# Altium project old_singleboard_now_mcu.PrjPcb (part 2 of 4)

## Sheet vca_A.SchDoc
size 381 x 241 mm; SheetNumber: 3; SheetTotal: 12
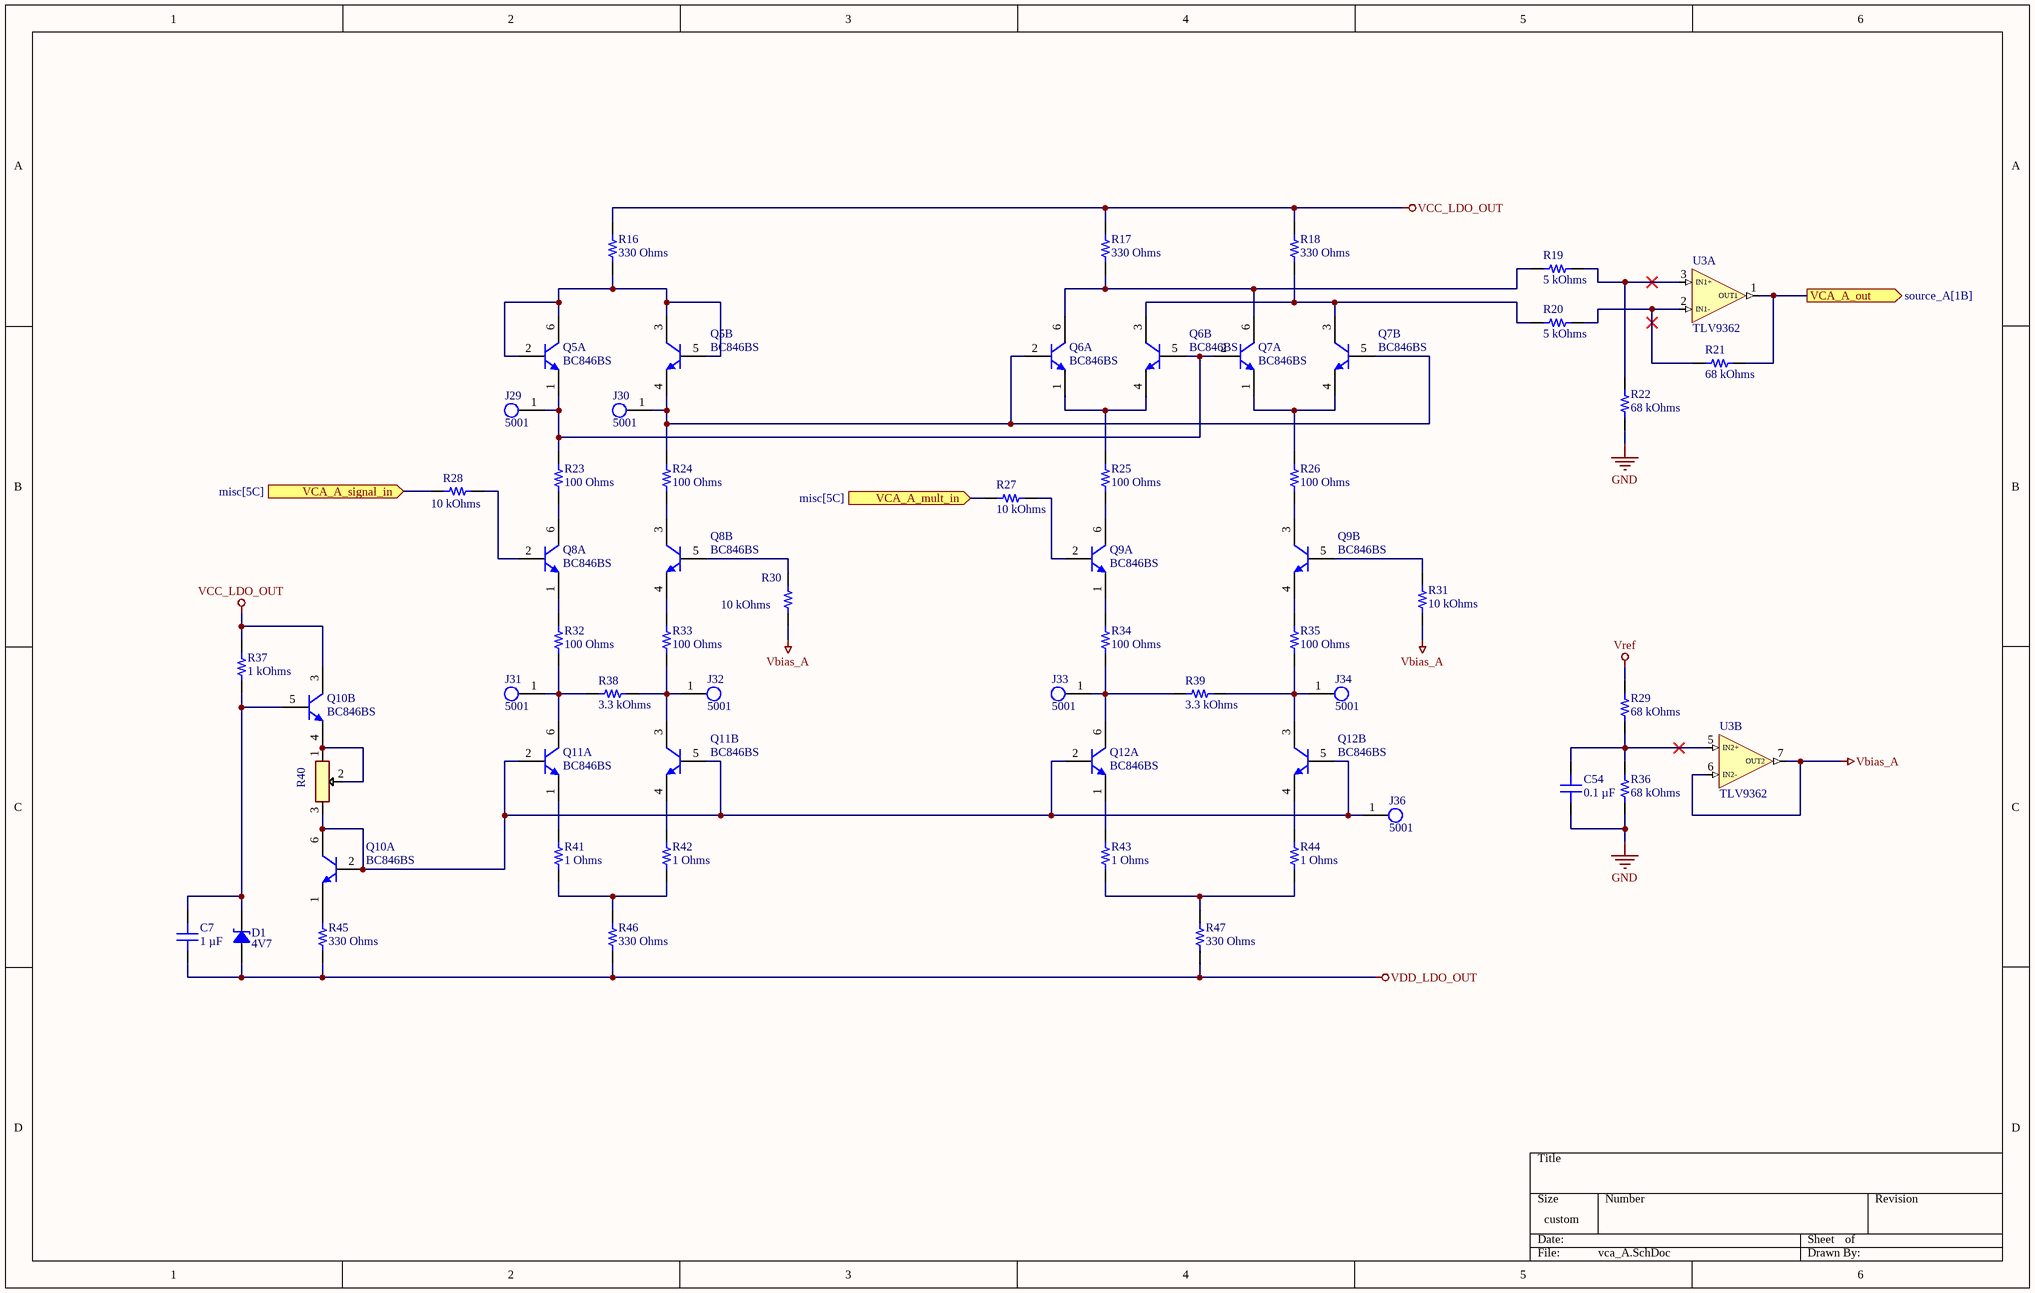
[diagram p2: vca_A.SchDoc]

### Parts
(Parts that share a designator on the sheet are numbered #1, #2 ... from top to bottom, then left to right.)
C7#1  1 µF  [CAP 1206_3216 - 0.8MM]
C54#1  0.1 µF  [CAP 1206_3216 - 0.8MM]
D1#1  4V7  [SOD323]
J29  5001  [FP-5001-MFG]
J30  5001  [FP-5001-MFG]
J31  5001  [FP-5001-MFG]
J32  5001  [FP-5001-MFG]
J33  5001  [FP-5001-MFG]
J34  5001  [FP-5001-MFG]
J36  5001  [FP-5001-MFG]
Q5  BC846BS  [TSOP65P210X110-6N]  (parts A,B of 2)
Q6  BC846BS  [TSOP65P210X110-6N]  (parts A,B of 2)
Q7  BC846BS  [TSOP65P210X110-6N]  (parts A,B of 2)
Q8  BC846BS  [TSOP65P210X110-6N]  (parts A,B of 2)
Q9  BC846BS  [TSOP65P210X110-6N]  (parts A,B of 2)
Q10  BC846BS  [TSOP65P210X110-6N]  (parts A,B of 2)
Q11  BC846BS  [TSOP65P210X110-6N]  (parts A,B of 2)
Q12  BC846BS  [TSOP65P210X110-6N]  (parts A,B of 2)
R16#1  330 Ohms  [YAGEO RES 1206_3216]
R17#1  330 Ohms  [YAGEO RES 1206_3216]
R18#1  330 Ohms  [YAGEO RES 1206_3216]
R19#1  5 kOhms  [YAGEO RES 1206_3216]
R20#1  5 kOhms  [YAGEO RES 1206_3216]
R21#1  68 kOhms  [YAGEO RES 1206_3216]
R22#1  68 kOhms  [YAGEO RES 1206_3216]
R23#1  100 Ohms  [YAGEO RES 1206_3216]
R24#1  100 Ohms  [YAGEO RES 1206_3216]
R25#1  100 Ohms  [YAGEO RES 1206_3216]
R26#1  100 Ohms  [YAGEO RES 1206_3216]
R27#1  10 kOhms  [YAGEO RES 1206_3216]
R28#1  10 kOhms  [YAGEO RES 1206_3216]
R29#1  68 kOhms  [YAGEO RES 1206_3216]
R30#1  10 kOhms  [YAGEO RES 1206_3216]
R31#1  10 kOhms  [YAGEO RES 1206_3216]
R32#1  100 Ohms  [YAGEO RES 1206_3216]
R33#1  100 Ohms  [YAGEO RES 1206_3216]
R34#1  100 Ohms  [YAGEO RES 1206_3216]
R35#1  100 Ohms  [YAGEO RES 1206_3216]
R36#1  68 kOhms  [YAGEO RES 1206_3216]
R37#1  1 kOhms  [YAGEO RES 1206_3216]
R38#1  3.3 kOhms  [YAGEO RES 1206_3216]
R39#1  3.3 kOhms  [YAGEO RES 1206_3216]
R40#1  TC33X-2-502G  [TC33X2503E]  (value not drawn)
R41#1  1 Ohms  [YAGEO RES 1206_3216]
R42#1  1 Ohms  [YAGEO RES 1206_3216]
R43#1  1 Ohms  [YAGEO RES 1206_3216]
R44#1  1 Ohms  [YAGEO RES 1206_3216]
R45  330 Ohms  [YAGEO RES 1206_3216]
R46  330 Ohms  [YAGEO RES 1206_3216]
R47  330 Ohms  [YAGEO RES 1206_3216]
U3  TLV9362  [SOIC8-127P600X175-8N]  (parts A,B of 3)

### Ports
VCA_A_mult_in (in, see misc[5C]), VCA_A_out (out, see source_A[1B]), VCA_A_signal_in (in, see misc[5C])

### Nets
GND: C54#1.1 R22#1.2 R36#1.1
Vbias_A: R30#1.1 R31#1.1 U3.6(IN2-) U3.7(OUT2)
VCC_LDO_OUT: Q10.3(C2) R16#1.2 R17#1.2 R18#1.2 R37#1.2
VDD_LDO_OUT: C7#1.1 D1#1.1 R45.1 R46.1 R47.1
Vref: R29#1.2
NetC7#1_2: C7#1.2 D1#1.2 Q10.5(B2) R37#1.1
NetC54#1_2: C54#1.2 R29#1.1 R36#1.2 U3.5(IN2+)
NetJ14_1: R21#1.1 U3.1(OUT1) ; port VCA_A_out
NetJ29_1: J29.1 Q5.1(E1) Q6.5(B2) Q7.2(B1) R23#1.2
NetJ30_1: J30.1 Q5.4(E2) Q6.2(B1) Q7.5(B2) R24#1.2
NetJ31_1: J31.1 Q11.6(C1) R32#1.1 R38#1.2
NetJ32_1: J32.1 Q11.3(C2) R33#1.1 R38#1.1
NetJ33_1: J33.1 Q12.6(C1) R34#1.1 R39#1.2
NetJ34_1: J34.1 Q12.3(C2) R35#1.1 R39#1.1
NetJ36_1: J36.1 Q10.2(B1) Q10.6(C1) Q11.2(B1) Q11.5(B2) Q12.2(B1) Q12.5(B2) R40#1.3(CW)
NetQ5_2: Q5.2(B1) Q5.3(C2) Q5.5(B2) Q5.6(C1) R16#1.1
NetQ6_1: Q6.1(E1) Q6.4(E2) R25#1.2
NetQ6_3: Q6.3(C2) Q7.3(C2) R18#1.1 R20#1.2
NetQ6_6: Q6.6(C1) Q7.6(C1) R17#1.1 R19#1.2
NetQ7_1: Q7.1(E1) Q7.4(E2) R26#1.2
NetQ8_1: Q8.1(E1) R32#1.2
NetQ8_2: Q8.2(B1) R28#1.2
NetQ8_3: Q8.3(C2) R24#1.1
NetQ8_4: Q8.4(E2) R33#1.2
NetQ8_5: Q8.5(B2) R30#1.2
NetQ8_6: Q8.6(C1) R23#1.1
NetQ9_1: Q9.1(E1) R34#1.2
NetQ9_2: Q9.2(B1) R27#1.2
NetQ9_3: Q9.3(C2) R26#1.1
NetQ9_4: Q9.4(E2) R35#1.2
NetQ9_5: Q9.5(B2) R31#1.2
NetQ9_6: Q9.6(C1) R25#1.1
NetQ10_1: Q10.1(E1) R45.2
NetQ10_4: Q10.4(E2) R40#1.1(CCW) R40#1.2(W)
NetQ11_1: Q11.1(E1) R41#1.2
NetQ11_4: Q11.4(E2) R42#1.2
NetQ12_1: Q12.1(E1) R43#1.2
NetQ12_4: Q12.4(E2) R44#1.2
NetR1#2_1: R28#1.1 ; port VCA_A_signal_in
NetR19#1_1: R19#1.1 R22#1.1 U3.3(IN1+)
NetR20#1_1: R20#1.1 R21#1.2 U3.2(IN1-)
NetR27#1_1: R27#1.1 ; port VCA_A_mult_in
NetR41#1_1: R41#1.1 R42#1.1 R46.2
NetR43#1_1: R43#1.1 R44#1.1 R47.2

### Library data of the parts
C7#1 = 885012208093: CAP CER 1UF 50V X7R 1206; manufacturer: Würth Elektronik; Tolerance: ±10%; Part Number: 885012208093; Capacitance: 1 µF; Applications: General Purpose; componentlink1description: Datasheet; componentlink1url: https://katalog.we-online.de/pbs/datasheet/885012208093.pdf; componentlink2description: DigiKey Link; componentlink2url: https://www.digikey.com/en/products/detail/würth-elektronik/885012208093/5453432; Device Package: 1206 (3216 Metric); lastupdated: 6/4/2024 19:10:33; Lifecycle Status: Active; Minimum Order: 1; Mounting Type: Surface Mount, MLCC; Operating Temperature: -55°C ~ 125°C; Package / Case: 1206 (3216 Metric); packaging: TapeAndReel; partid: 39665; Part Status: Active; price: 0.10; series: WCAP-CSGP; Size / Dimension: 0.126" L x 0.063" W (3.20mm x 1.60mm); Supplier 1: DigiKey; Supplier Part Number 1: 732-7577-1-ND; Temperature Coefficient: X7R; Thickness (Max): 0.075" (1.90mm); value: 1 µF; Voltage - Rated: 50V
C54#1 = 885012208087: CAP CER 0.1UF 50V X7R 1206; manufacturer: Würth Elektronik; Tolerance: ±10%; Part Number: 885012208087; Capacitance: 0.1 µF; Applications: General Purpose; componentlink1description: Datasheet; componentlink1url: https://katalog.we-online.de/pbs/datasheet/885012208087.pdf; componentlink2description: DigiKey Link; componentlink2url: https://www.digikey.com/en/products/detail/würth-elektronik/885012208087/5453982; Device Package: 1206 (3216 Metric); lastupdated: 6/4/2024 19:10:27; Lifecycle Status: Active; Minimum Order: 1; Mounting Type: Surface Mount, MLCC; Operating Temperature: -55°C ~ 125°C; Package / Case: 1206 (3216 Metric); packaging: TapeAndReel; partid: 20879; Part Status: Active; price: 0.06; series: WCAP-CSGP; Size / Dimension: 0.126" L x 0.063" W (3.20mm x 1.60mm); Supplier 1: DigiKey; Supplier Part Number 1: 732-8127-1-ND; Temperature Coefficient: X7R; Thickness (Max): 0.035" (0.90mm); value: 0.1 µF; Voltage - Rated: 50V
D1#1 = BZX38450-C4V7X
J29-J34 J36 = CMP-2000-05181-2: PC TEST POINT MINIATURE BLACK; Body Material: Bronze; Plating: Silver; Inside Diameter: 1.27mm; Hole Diameter: 1.6mm; Number of Ports: 1; Outside Diameter: 2.54mm; Insulation: Insulated; Insulation Material: Nylon; Mount: Through Hole; RoHS Compliant: Yes; Series: THM; Height: 0.3inch; Termination: Through Hole; Material: Nylon; Packaging: Bulk; Contact Material: Bronze; REACH SVHC: No SVHC; Contact Plating: Silver; Orientation: Straight; Lead Free: Lead Free; Package Quantity: 100; Length: 7.62mm; Flammability Rating: UL94 V-0; Number of Contacts: 1; Diameter: 2.54mm; Housing Color: Black; Color: Black
Q5-Q12 = BC846BS: 65 V, 100 mA matched NPN/NPN general-purpose transistor; ComponentLink1Description: Datasheet; ComponentLink1URL: https://assets.nexperia.com/documents/data-sheet/BC846BS.pdf
R16#1 R17#1 R18#1 R45-R47 = RT1206FRD07330RL: RES SMD 330 OHM 1% 1/4W 1206; Manufacturer: Yageo; Power (Watts): 0.25W, 1/4W; Temperature Coefficient: ±25ppm/°C; Part Number: RT1206FRD07330RL; ComponentLink1Description: Datasheet; ComponentLink1URL: https://www.yageo.com/upload/media/product/productsearch/datasheet/rchip/PYu-RT_1-to-0.01_RoHS_L_15.pdf; ComponentLink2Description: DigiKey Link; ComponentLink2URL: https://www.digikey.com/en/products/detail/yageo/RT1206FRD07330RL/5938576; Composition: Thin Film; Device Package: 1206 (3216 Metric); Height - Seated (Max): 0.026" (0.65mm); LastUpdated: 7/25/2024 09:21:16; Lifecycle Status: Active; Minimum Order: 1; Number of Terminations: 2; Operating Temperature: -55°C ~ 155°C; Package / Case: 1206 (3216 Metric); Packaging: TapeAndReel; PartId: 79140; Price: 0.01; Resistance: 330 Ohms; Series: RT; Size / Dimension: 0.122" L x 0.063" W (3.10mm x 1.60mm); Supplier 1: DigiKey; Supplier Part Number 1: 13-RT1206FRD07330RLCT-ND; Supplier Device Package: 1206; Tolerance: ±1%; Value: 330 Ohms
R19#1 R20#1 = RT1206FRE075KL: RES 5K OHM 1% 1/4W 1206; Manufacturer: Yageo; Power (Watts): 0.25W, 1/4W; Temperature Coefficient: ±50ppm/°C; Part Number: RT1206FRE075KL; ComponentLink1Description: Datasheet; ComponentLink1URL: https://www.yageo.com/upload/media/product/app/datasheet/rchip/pyu-rt_1-to-0.01_rohs_l.pdf; ComponentLink2Description: DigiKey Link; ComponentLink2URL: https://www.digikey.com/en/products/detail/yageo/RT1206FRE075KL/7708705; Composition: Thin Film; Device Package: 1206 (3216 Metric); Height - Seated (Max): 0.026" (0.65mm); LastUpdated: 7/25/2024 09:21:03; Lifecycle Status: Active; Minimum Order: 1; Number of Terminations: 2; Operating Temperature: -55°C ~ 155°C; Package / Case: 1206 (3216 Metric); Packaging: TapeAndReel; PartId: 88354; Price: 0.01; Resistance: 5 kOhms; Series: RT; Size / Dimension: 0.122" L x 0.063" W (3.10mm x 1.60mm); Supplier 1: DigiKey; Supplier Part Number 1: 13-RT1206FRE075KLCT-ND; Supplier Device Package: 1206; Tolerance: ±1%; Value: 5 kOhms
R21#1 R22#1 R29#1 R36#1 = RT1206FRE0768KL: RES SMD 68K OHM 1% 1/4W 1206; Manufacturer: Yageo; Power (Watts): 0.25W, 1/4W; Temperature Coefficient: ±50ppm/°C; Part Number: RT1206FRE0768KL; ComponentLink1Description: Datasheet; ComponentLink1URL: https://www.yageo.com/upload/media/product/productsearch/datasheet/rchip/PYu-RT_1-to-0.01_RoHS_L_12.pdf; ComponentLink2Description: DigiKey Link; ComponentLink2URL: https://www.digikey.com/en/products/detail/yageo/RT1206FRE0768KL/1083332; Composition: Thin Film; Device Package: 1206 (3216 Metric); Height - Seated (Max): 0.026" (0.65mm); LastUpdated: 7/25/2024 09:21:23; Lifecycle Status: Active; Minimum Order: 1; Number of Terminations: 2; Operating Temperature: -55°C ~ 155°C; Package / Case: 1206 (3216 Metric); Packaging: TapeAndReel; PartId: 58462; Part Status: Active; Price: 0.01; Resistance: 68 kOhms; Series: RT; Size / Dimension: 0.122" L x 0.063" W (3.10mm x 1.60mm); Supplier 1: DigiKey; Supplier Part Number 1: 13-RT1206FRE0768KLCT-ND; Supplier Device Package: 1206; Tolerance: ±1%; Value: 68 kOhms
R23#1 R24#1 R25#1 R26#1 R32#1 R33#1 R34#1 R35#1 = RT1206FRD07100RL: RES SMD 100 OHM 1% 1/4W 1206; Manufacturer: Yageo; Power (Watts): 0.25W, 1/4W; Temperature Coefficient: ±25ppm/°C; Part Number: RT1206FRD07100RL; ComponentLink1Description: Datasheet; ComponentLink1URL: https://www.yageo.com/upload/media/product/productsearch/datasheet/rchip/PYu-RT_1-to-0.01_RoHS_L_12.pdf; ComponentLink2Description: DigiKey Link; ComponentLink2URL: https://www.digikey.com/en/products/detail/yageo/RT1206FRD07100RL/5938292; Composition: Thin Film; Device Package: 1206 (3216 Metric); Height - Seated (Max): 0.026" (0.65mm); LastUpdated: 7/25/2024 09:21:23; Lifecycle Status: Active; Minimum Order: 1; Number of Terminations: 2; Operating Temperature: -55°C ~ 155°C; Package / Case: 1206 (3216 Metric); Packaging: TapeAndReel; PartId: 58461; Part Status: Active; Price: 0.01; Resistance: 100 Ohms; Series: RT; Size / Dimension: 0.122" L x 0.063" W (3.10mm x 1.60mm); Supplier 1: DigiKey; Supplier Part Number 1: 13-RT1206FRD07100RLCT-ND; Supplier Device Package: 1206; Tolerance: ±1%; Value: 100 Ohms
R27#1 R28#1 R30#1 R31#1 = RT1206FRE0710KL: RES SMD 10K OHM 1% 1/4W 1206; Manufacturer: Yageo; Power (Watts): 0.25W, 1/4W; Temperature Coefficient: ±50ppm/°C; Part Number: RT1206FRE0710KL; ComponentLink1Description: Datasheet; ComponentLink1URL: https://www.yageo.com/upload/media/product/productsearch/datasheet/rchip/PYu-RT_1-to-0.01_RoHS_L_11.pdf; ComponentLink2Description: DigiKey Link; ComponentLink2URL: https://www.digikey.com/en/products/detail/yageo/RT1206FRE0710KL/1082868; Composition: Thin Film; Device Package: 1206 (3216 Metric); Height - Seated (Max): 0.026" (0.65mm); LastUpdated: 7/25/2024 09:21:28; Lifecycle Status: Active; Minimum Order: 1; Number of Terminations: 2; Operating Temperature: -55°C ~ 155°C; Package / Case: 1206 (3216 Metric); Packaging: TapeAndReel; PartId: 38903; Part Status: Active; Price: 0.01; Resistance: 10 kOhms; Series: RT; Size / Dimension: 0.122" L x 0.063" W (3.10mm x 1.60mm); Supplier 1: DigiKey; Supplier Part Number 1: YAG1242CT-ND; Supplier Device Package: 1206; Tolerance: ±1%; Value: 10 kOhms
R37#1 = RT1206FRE071KL: RES SMD 1K OHM 1% 1/4W 1206; Manufacturer: Yageo; Power (Watts): 0.25W, 1/4W; Temperature Coefficient: ±50ppm/°C; Part Number: RT1206FRE071KL; ComponentLink1Description: Datasheet; ComponentLink1URL: https://www.yageo.com/upload/media/product/productsearch/datasheet/rchip/PYu-RT_1-to-0.01_RoHS_L_11.pdf; ComponentLink2Description: DigiKey Link; ComponentLink2URL: https://www.digikey.com/en/products/detail/yageo/RT1206FRE071KL/1083016; Composition: Thin Film; Device Package: 1206 (3216 Metric); Height - Seated (Max): 0.026" (0.65mm); LastUpdated: 7/25/2024 09:21:27; Lifecycle Status: Active; Minimum Order: 1; Number of Terminations: 2; Operating Temperature: -55°C ~ 155°C; Package / Case: 1206 (3216 Metric); Packaging: TapeAndReel; PartId: 40465; Part Status: Active; Price: 0.01; Resistance: 1 kOhms; Series: RT; Size / Dimension: 0.122" L x 0.063" W (3.10mm x 1.60mm); Supplier 1: DigiKey; Supplier Part Number 1: YAG3366CT-ND; Supplier Device Package: 1206; Tolerance: ±1%; Value: 1 kOhms
R38#1 R39#1 = RT1206FRE073K3L: RES SMD 3.3K OHM 1% 1/4W 1206; Manufacturer: Yageo; Power (Watts): 0.25W, 1/4W; Temperature Coefficient: ±50ppm/°C; Part Number: RT1206FRE073K3L; ComponentLink1Description: Datasheet; ComponentLink1URL: https://www.yageo.com/upload/media/product/productsearch/datasheet/rchip/PYu-RT_1-to-0.01_RoHS_L_12.pdf; ComponentLink2Description: DigiKey Link; ComponentLink2URL: https://www.digikey.com/en/products/detail/yageo/RT1206FRE073K3L/1083187; Composition: Thin Film; Device Package: 1206 (3216 Metric); Height - Seated (Max): 0.026" (0.65mm); LastUpdated: 7/25/2024 09:21:22; Lifecycle Status: Active; Minimum Order: 1; Number of Terminations: 2; Operating Temperature: -55°C ~ 155°C; Package / Case: 1206 (3216 Metric); Packaging: TapeAndReel; PartId: 58380; Price: 0.01; Resistance: 3.3 kOhms; Series: RT; Size / Dimension: 0.122" L x 0.063" W (3.10mm x 1.60mm); Supplier 1: DigiKey; Supplier Part Number 1: 13-RT1206FRE073K3LCT-ND; Supplier Device Package: 1206; Tolerance: ±1%; Value: 3.3 kOhms; Part Status: Active
R40#1 = TC33X-2-502G: Resistor; Manufacturer_Name: Bourns; Datasheet Link: https://componentsearchengine.com/Datasheets/1/TC33X-2-502G.pdf; Height: 1.2mm; Manufacturer_Part_Number: TC33X-2-502G; Mouser Part Number: 652-TC33X-2-502G; Mouser Price/Stock: https://www.mouser.co.uk/ProductDetail/Bourns/TC33X-2-502G?qs=UmpSLsh52mVfPYqLYJpjzQ%3D%3D; Arrow Part Number: TC33X-2-502G; Arrow Price/Stock: https://www.arrow.com/en/products/tc33x-2-502g/bourns?region=nac
R41#1 R42#1 R43#1 R44#1 = RT1206BRD071RL: RES 1 OHM 0.1% 1/4W 1206; Manufacturer: Yageo; Power (Watts): 0.25W, 1/4W; Temperature Coefficient: ±25ppm/°C; Part Number: RT1206BRD071RL; ComponentLink1Description: Datasheet; ComponentLink1URL: https://www.yageo.com/upload/media/product/productsearch/datasheet/rchip/PYu-RT_1-to-0.01_RoHS_L_15.pdf; ComponentLink2Description: DigiKey Link; ComponentLink2URL: https://www.digikey.com/en/products/detail/yageo/RT1206BRD071RL/17018181; Composition: Thin Film; Device Package: 1206 (3216 Metric); Features: Moisture Resistant; Height - Seated (Max): 0.026" (0.65mm); LastUpdated: 7/25/2024 09:21:16; Lifecycle Status: Active; Minimum Order: 1; Number of Terminations: 2; Operating Temperature: -55°C ~ 155°C; Package / Case: 1206 (3216 Metric); Packaging: TapeAndReel; PartId: 79150; Price: 0.14; Resistance: 1 Ohms; Series: RT; Size / Dimension: 0.122" L x 0.063" W (3.10mm x 1.60mm); Supplier 1: DigiKey; Supplier Part Number 1: 13-RT1206BRD071RLCT-ND; Supplier Device Package: 1206; Tolerance: ±0.1%; Value: 1 Ohms
U3 = TLV9362: TLV936x 10-MHz, 40-V, RRO, Operational Amplifie; ComponentLink1Description: Datasheet; ComponentLink1URL: https://www.ti.com/lit/ds/symlink/tlv9362.pdf

## Sheet vca_B.SchDoc
size 381 x 241 mm; SheetNumber: 4; SheetTotal: 12
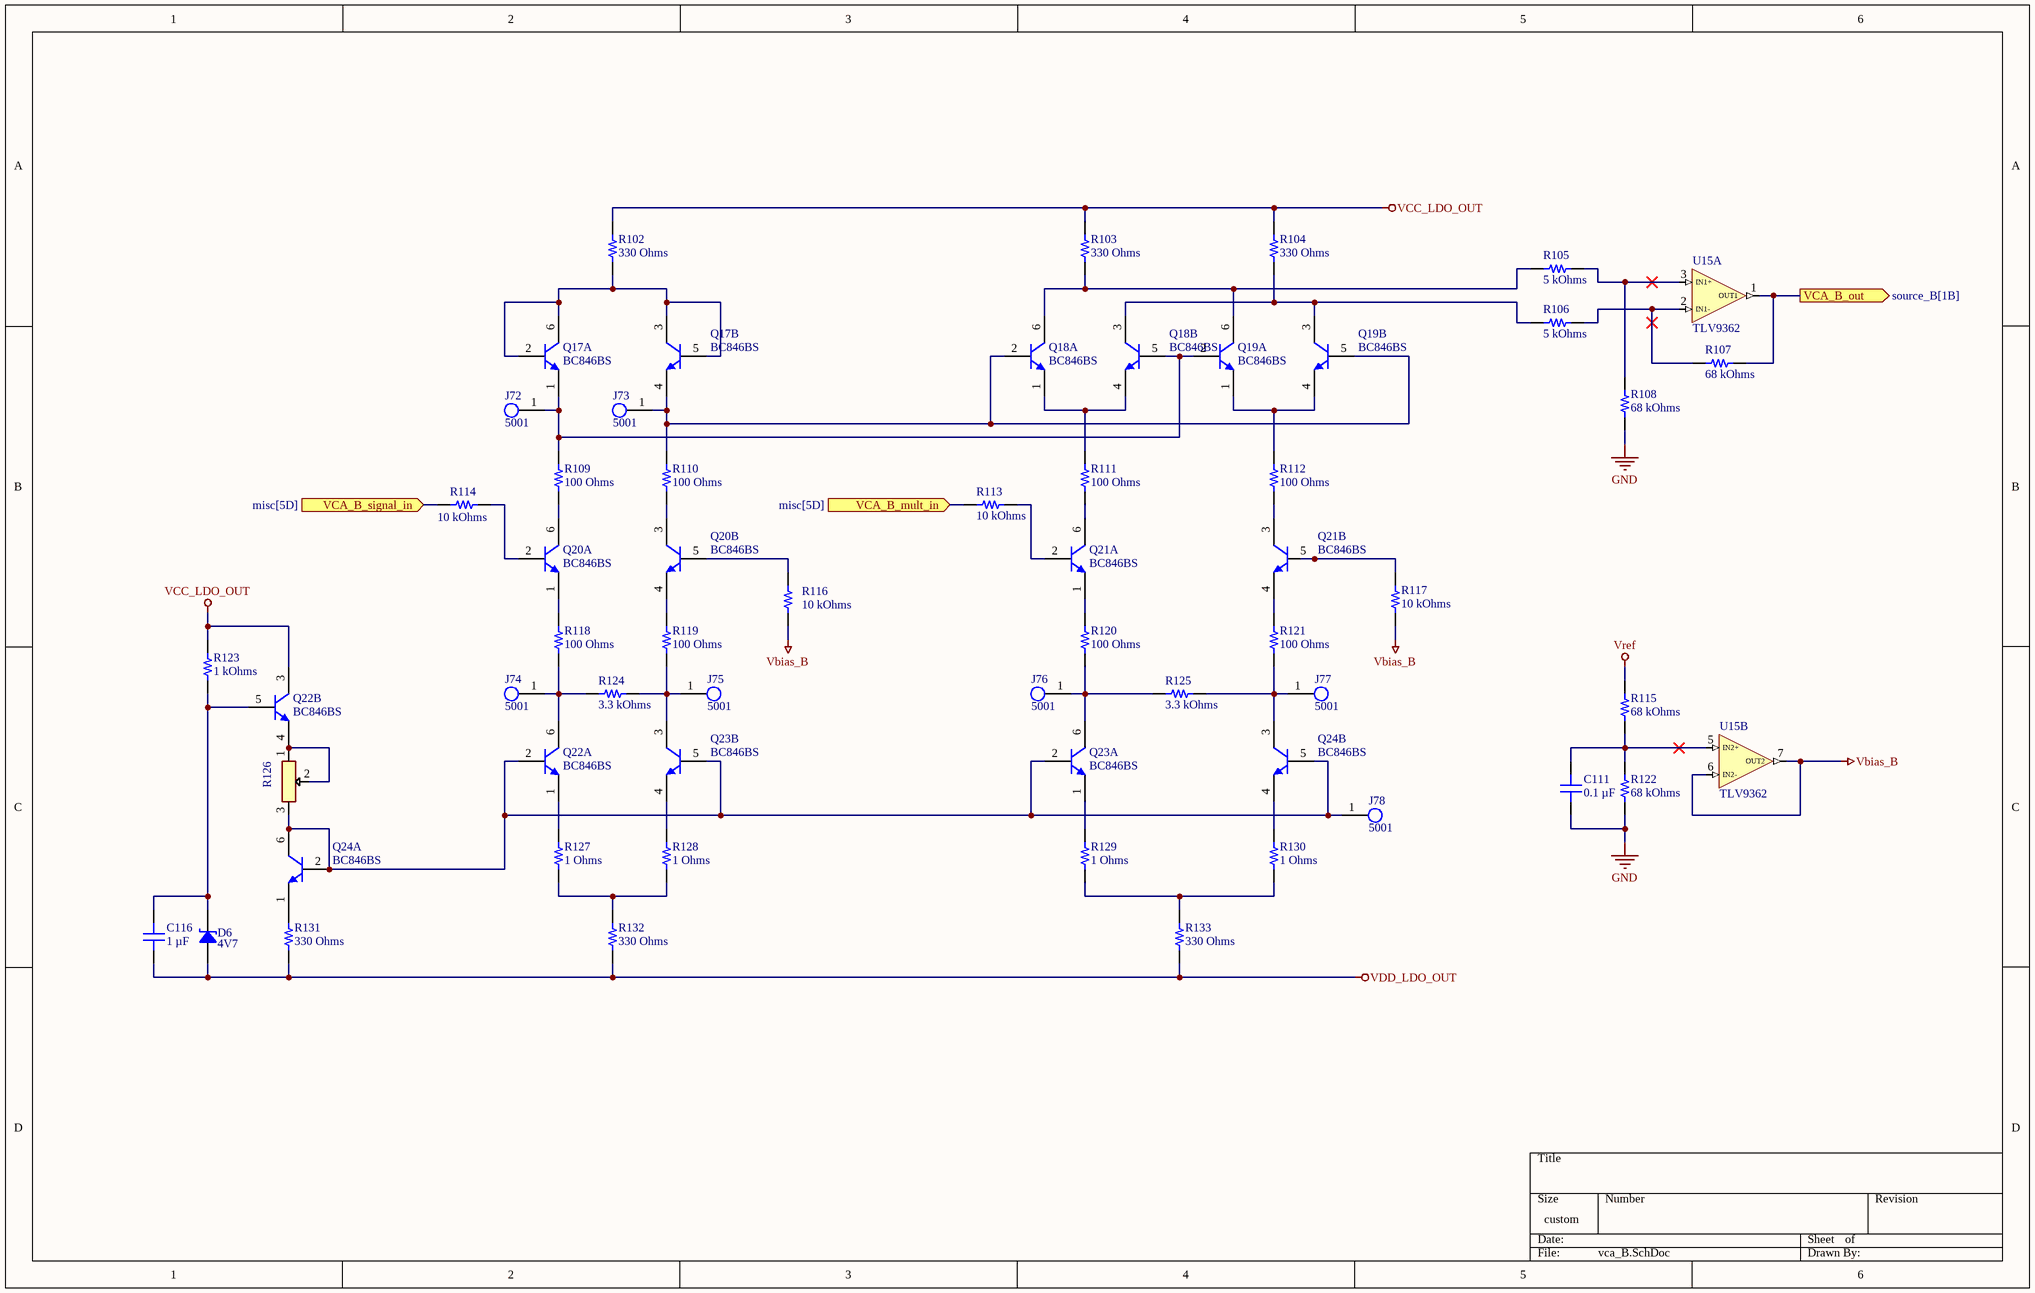
[diagram p3: vca_B.SchDoc]

### Parts
(Parts that share a designator on the sheet are numbered #1, #2 ... from top to bottom, then left to right.)
C111  0.1 µF  [CAP 1206_3216 - 0.8MM]
C116  1 µF  [CAP 1206_3216 - 0.8MM]
D6#1  4V7  [SOD323]
J72  5001  [FP-5001-MFG]
J73  5001  [FP-5001-MFG]
J74  5001  [FP-5001-MFG]
J75  5001  [FP-5001-MFG]
J76  5001  [FP-5001-MFG]
J77  5001  [FP-5001-MFG]
J78  5001  [FP-5001-MFG]
Q17  BC846BS  [TSOP65P210X110-6N]  (parts A,B of 2)
Q18  BC846BS  [TSOP65P210X110-6N]  (parts A,B of 2)
Q19  BC846BS  [TSOP65P210X110-6N]  (parts A,B of 2)
Q20  BC846BS  [TSOP65P210X110-6N]  (parts A,B of 2)
Q21  BC846BS  [TSOP65P210X110-6N]  (parts A,B of 2)
Q22  BC846BS  [TSOP65P210X110-6N]  (parts A,B of 2)
Q23  BC846BS  [TSOP65P210X110-6N]  (parts A,B of 2)
Q24  BC846BS  [TSOP65P210X110-6N]  (parts A,B of 2)
R102  330 Ohms  [YAGEO RES 1206_3216]
R103  330 Ohms  [YAGEO RES 1206_3216]
R104  330 Ohms  [YAGEO RES 1206_3216]
R105  5 kOhms  [YAGEO RES 1206_3216]
R106  5 kOhms  [YAGEO RES 1206_3216]
R107  68 kOhms  [YAGEO RES 1206_3216]
R108  68 kOhms  [YAGEO RES 1206_3216]
R109  100 Ohms  [YAGEO RES 1206_3216]
R110  100 Ohms  [YAGEO RES 1206_3216]
R111  100 Ohms  [YAGEO RES 1206_3216]
R112  100 Ohms  [YAGEO RES 1206_3216]
R113  10 kOhms  [YAGEO RES 1206_3216]
R114  10 kOhms  [YAGEO RES 1206_3216]
R115  68 kOhms  [YAGEO RES 1206_3216]
R116  10 kOhms  [YAGEO RES 1206_3216]
R117  10 kOhms  [YAGEO RES 1206_3216]
R118  100 Ohms  [YAGEO RES 1206_3216]
R119  100 Ohms  [YAGEO RES 1206_3216]
R120  100 Ohms  [YAGEO RES 1206_3216]
R121  100 Ohms  [YAGEO RES 1206_3216]
R122  68 kOhms  [YAGEO RES 1206_3216]
R123  1 kOhms  [YAGEO RES 1206_3216]
R124  3.3 kOhms  [YAGEO RES 1206_3216]
R125  3.3 kOhms  [YAGEO RES 1206_3216]
R126  TC33X-2-502G  [TC33X2503E]  (value not drawn)
R127  1 Ohms  [YAGEO RES 1206_3216]
R128  1 Ohms  [YAGEO RES 1206_3216]
R129  1 Ohms  [YAGEO RES 1206_3216]
R130  1 Ohms  [YAGEO RES 1206_3216]
R131  330 Ohms  [YAGEO RES 1206_3216]
R132  330 Ohms  [YAGEO RES 1206_3216]
R133  330 Ohms  [YAGEO RES 1206_3216]
U15  TLV9362  [SOIC8-127P600X175-8N]  (parts A,B of 3)

### Ports
VCA_B_mult_in (in, see misc[5D]), VCA_B_out (out, see source_B[1B]), VCA_B_signal_in (in, see misc[5D])

### Nets
GND: C111.1 R108.2 R122.1
Vbias_B: R116.1 R117.1 U15.6(IN2-) U15.7(OUT2)
VCC_LDO_OUT: Q22.3(C2) R102.2 R103.2 R104.2 R123.2
VDD_LDO_OUT: C116.1 D6#1.1 R131.1 R132.1 R133.1
Vref: R115.2
NetC111_2: C111.2 R115.1 R122.2 U15.5(IN2+)
NetC116_2: C116.2 D6#1.2 Q22.5(B2) R123.1
NetJ20_1: R107.1 U15.1(OUT1) ; port VCA_B_out
NetJ72_1: J72.1 Q17.1(E1) Q18.5(B2) Q19.2(B1) R109.2
NetJ73_1: J73.1 Q17.4(E2) Q18.2(B1) Q19.5(B2) R110.2
NetJ74_1: J74.1 Q22.6(C1) R118.1 R124.2
NetJ75_1: J75.1 Q23.3(C2) R119.1 R124.1
NetJ76_1: J76.1 Q23.6(C1) R120.1 R125.2
NetJ77_1: J77.1 Q24.3(C2) R121.1 R125.1
NetJ78_1: J78.1 Q22.2(B1) Q23.2(B1) Q23.5(B2) Q24.2(B1) Q24.5(B2) Q24.6(C1) R126.3(CW)
NetQ17_2: Q17.2(B1) Q17.3(C2) Q17.5(B2) Q17.6(C1) R102.1
NetQ18_1: Q18.1(E1) Q18.4(E2) R111.2
NetQ18_3: Q18.3(C2) Q19.3(C2) R104.1 R106.2
NetQ18_6: Q18.6(C1) Q19.6(C1) R103.1 R105.2
NetQ19_1: Q19.1(E1) Q19.4(E2) R112.2
NetQ20_1: Q20.1(E1) R118.2
NetQ20_2: Q20.2(B1) R114.2
NetQ20_3: Q20.3(C2) R110.1
NetQ20_4: Q20.4(E2) R119.2
NetQ20_5: Q20.5(B2) R116.2
NetQ20_6: Q20.6(C1) R109.1
NetQ21_1: Q21.1(E1) R120.2
NetQ21_2: Q21.2(B1) R113.2
NetQ21_3: Q21.3(C2) R112.1
NetQ21_4: Q21.4(E2) R121.2
NetQ21_5: Q21.5(B2) R117.2
NetQ21_6: Q21.6(C1) R111.1
NetQ22_1: Q22.1(E1) R127.2
NetQ22_4: Q22.4(E2) R126.1(CCW) R126.2(W)
NetQ23_1: Q23.1(E1) R129.2
NetQ23_4: Q23.4(E2) R128.2
NetQ24_1: Q24.1(E1) R131.2
NetQ24_4: Q24.4(E2) R130.2
NetR36#2_1: R114.1 ; port VCA_B_signal_in
NetR37#2_1: R113.1 ; port VCA_B_mult_in
NetR105_1: R105.1 R108.1 U15.3(IN1+)
NetR106_1: R106.1 R107.2 U15.2(IN1-)
NetR127_1: R127.1 R128.1 R132.2
NetR129_1: R129.1 R130.1 R133.2

### Library data of the parts
C111 = 885012208087: as C54#1 on sheet vca_A; Part Number: 885012208087; Capacitance: 0.1 µF; Applications: General Purpose; componentlink1description: Datasheet; componentlink1url: https://katalog.we-online.de/pbs/datasheet/885012208087.pdf; componentlink2description: DigiKey Link; componentlink2url: https://www.digikey.com/en/products/detail/würth-elektronik/885012208087/5453982; Device Package: 1206 (3216 Metric); lastupdated: 6/4/2024 19:10:27; Lifecycle Status: Active; Minimum Order: 1; Mounting Type: Surface Mount, MLCC; Operating Temperature: -55°C ~ 125°C; Package / Case: 1206 (3216 Metric); packaging: TapeAndReel; partid: 20879; Part Status: Active; price: 0.06; series: WCAP-CSGP; Size / Dimension: 0.126" L x 0.063" W (3.20mm x 1.60mm); Supplier 1: DigiKey; Supplier Part Number 1: 732-8127-1-ND; Temperature Coefficient: X7R; Thickness (Max): 0.035" (0.90mm); value: 0.1 µF; Voltage - Rated: 50V
C116 = 885012208093: as C7#1 on sheet vca_A; Part Number: 885012208093; Capacitance: 1 µF; Applications: General Purpose; componentlink1description: Datasheet; componentlink1url: https://katalog.we-online.de/pbs/datasheet/885012208093.pdf; componentlink2description: DigiKey Link; componentlink2url: https://www.digikey.com/en/products/detail/würth-elektronik/885012208093/5453432; Device Package: 1206 (3216 Metric); lastupdated: 6/4/2024 19:10:33; Lifecycle Status: Active; Minimum Order: 1; Mounting Type: Surface Mount, MLCC; Operating Temperature: -55°C ~ 125°C; Package / Case: 1206 (3216 Metric); packaging: TapeAndReel; partid: 39665; Part Status: Active; price: 0.10; series: WCAP-CSGP; Size / Dimension: 0.126" L x 0.063" W (3.20mm x 1.60mm); Supplier 1: DigiKey; Supplier Part Number 1: 732-7577-1-ND; Temperature Coefficient: X7R; Thickness (Max): 0.075" (1.90mm); value: 1 µF; Voltage - Rated: 50V
D6#1 = BZX38450-C4V7X
J72-J78 = CMP-2000-05181-2: as J29 on sheet vca_A; Insulation Material: Nylon; Mount: Through Hole; RoHS Compliant: Yes; Series: THM; Height: 0.3inch; Termination: Through Hole; Material: Nylon; Packaging: Bulk; Contact Material: Bronze; REACH SVHC: No SVHC; Contact Plating: Silver; Orientation: Straight; Lead Free: Lead Free; Package Quantity: 100; Length: 7.62mm; Flammability Rating: UL94 V-0; Number of Contacts: 1; Diameter: 2.54mm; Housing Color: Black; Color: Black
Q17-Q24 = BC846BS: as Q5 on sheet vca_A; ComponentLink1Description: Datasheet; ComponentLink1URL: https://assets.nexperia.com/documents/data-sheet/BC846BS.pdf
R102-R104 R131-R133 = RT1206FRD07330RL: as R16#1 on sheet vca_A; Part Number: RT1206FRD07330RL; ComponentLink1Description: Datasheet; ComponentLink1URL: https://www.yageo.com/upload/media/product/productsearch/datasheet/rchip/PYu-RT_1-to-0.01_RoHS_L_15.pdf; ComponentLink2Description: DigiKey Link; ComponentLink2URL: https://www.digikey.com/en/products/detail/yageo/RT1206FRD07330RL/5938576; Composition: Thin Film; Device Package: 1206 (3216 Metric); Height - Seated (Max): 0.026" (0.65mm); LastUpdated: 7/25/2024 09:21:16; Lifecycle Status: Active; Minimum Order: 1; Number of Terminations: 2; Operating Temperature: -55°C ~ 155°C; Package / Case: 1206 (3216 Metric); Packaging: TapeAndReel; PartId: 79140; Price: 0.01; Resistance: 330 Ohms; Series: RT; Size / Dimension: 0.122" L x 0.063" W (3.10mm x 1.60mm); Supplier 1: DigiKey; Supplier Part Number 1: 13-RT1206FRD07330RLCT-ND; Supplier Device Package: 1206; Tolerance: ±1%; Value: 330 Ohms
R105 R106 = RT1206FRE075KL: as R19#1 on sheet vca_A; Part Number: RT1206FRE075KL; ComponentLink1Description: Datasheet; ComponentLink1URL: https://www.yageo.com/upload/media/product/app/datasheet/rchip/pyu-rt_1-to-0.01_rohs_l.pdf; ComponentLink2Description: DigiKey Link; ComponentLink2URL: https://www.digikey.com/en/products/detail/yageo/RT1206FRE075KL/7708705; Composition: Thin Film; Device Package: 1206 (3216 Metric); Height - Seated (Max): 0.026" (0.65mm); LastUpdated: 7/25/2024 09:21:03; Lifecycle Status: Active; Minimum Order: 1; Number of Terminations: 2; Operating Temperature: -55°C ~ 155°C; Package / Case: 1206 (3216 Metric); Packaging: TapeAndReel; PartId: 88354; Price: 0.01; Resistance: 5 kOhms; Series: RT; Size / Dimension: 0.122" L x 0.063" W (3.10mm x 1.60mm); Supplier 1: DigiKey; Supplier Part Number 1: 13-RT1206FRE075KLCT-ND; Supplier Device Package: 1206; Tolerance: ±1%; Value: 5 kOhms
R107 R108 R115 R122 = RT1206FRE0768KL: as R21#1 on sheet vca_A; Part Number: RT1206FRE0768KL; ComponentLink1Description: Datasheet; ComponentLink1URL: https://www.yageo.com/upload/media/product/productsearch/datasheet/rchip/PYu-RT_1-to-0.01_RoHS_L_12.pdf; ComponentLink2Description: DigiKey Link; ComponentLink2URL: https://www.digikey.com/en/products/detail/yageo/RT1206FRE0768KL/1083332; Composition: Thin Film; Device Package: 1206 (3216 Metric); Height - Seated (Max): 0.026" (0.65mm); LastUpdated: 7/25/2024 09:21:23; Lifecycle Status: Active; Minimum Order: 1; Number of Terminations: 2; Operating Temperature: -55°C ~ 155°C; Package / Case: 1206 (3216 Metric); Packaging: TapeAndReel; PartId: 58462; Part Status: Active; Price: 0.01; Resistance: 68 kOhms; Series: RT; Size / Dimension: 0.122" L x 0.063" W (3.10mm x 1.60mm); Supplier 1: DigiKey; Supplier Part Number 1: 13-RT1206FRE0768KLCT-ND; Supplier Device Package: 1206; Tolerance: ±1%; Value: 68 kOhms
R109-R112 R118-R121 = RT1206FRD07100RL: as R23#1 on sheet vca_A; Part Number: RT1206FRD07100RL; ComponentLink1Description: Datasheet; ComponentLink1URL: https://www.yageo.com/upload/media/product/productsearch/datasheet/rchip/PYu-RT_1-to-0.01_RoHS_L_12.pdf; ComponentLink2Description: DigiKey Link; ComponentLink2URL: https://www.digikey.com/en/products/detail/yageo/RT1206FRD07100RL/5938292; Composition: Thin Film; Device Package: 1206 (3216 Metric); Height - Seated (Max): 0.026" (0.65mm); LastUpdated: 7/25/2024 09:21:23; Lifecycle Status: Active; Minimum Order: 1; Number of Terminations: 2; Operating Temperature: -55°C ~ 155°C; Package / Case: 1206 (3216 Metric); Packaging: TapeAndReel; PartId: 58461; Part Status: Active; Price: 0.01; Resistance: 100 Ohms; Series: RT; Size / Dimension: 0.122" L x 0.063" W (3.10mm x 1.60mm); Supplier 1: DigiKey; Supplier Part Number 1: 13-RT1206FRD07100RLCT-ND; Supplier Device Package: 1206; Tolerance: ±1%; Value: 100 Ohms
R113 R114 R116 R117 = RT1206FRE0710KL: as R27#1 on sheet vca_A; Part Number: RT1206FRE0710KL; ComponentLink1Description: Datasheet; ComponentLink1URL: https://www.yageo.com/upload/media/product/productsearch/datasheet/rchip/PYu-RT_1-to-0.01_RoHS_L_11.pdf; ComponentLink2Description: DigiKey Link; ComponentLink2URL: https://www.digikey.com/en/products/detail/yageo/RT1206FRE0710KL/1082868; Composition: Thin Film; Device Package: 1206 (3216 Metric); Height - Seated (Max): 0.026" (0.65mm); LastUpdated: 7/25/2024 09:21:28; Lifecycle Status: Active; Minimum Order: 1; Number of Terminations: 2; Operating Temperature: -55°C ~ 155°C; Package / Case: 1206 (3216 Metric); Packaging: TapeAndReel; PartId: 38903; Part Status: Active; Price: 0.01; Resistance: 10 kOhms; Series: RT; Size / Dimension: 0.122" L x 0.063" W (3.10mm x 1.60mm); Supplier 1: DigiKey; Supplier Part Number 1: YAG1242CT-ND; Supplier Device Package: 1206; Tolerance: ±1%; Value: 10 kOhms
R123 = RT1206FRE071KL: as R37#1 on sheet vca_A; Part Number: RT1206FRE071KL; ComponentLink1Description: Datasheet; ComponentLink1URL: https://www.yageo.com/upload/media/product/productsearch/datasheet/rchip/PYu-RT_1-to-0.01_RoHS_L_11.pdf; ComponentLink2Description: DigiKey Link; ComponentLink2URL: https://www.digikey.com/en/products/detail/yageo/RT1206FRE071KL/1083016; Composition: Thin Film; Device Package: 1206 (3216 Metric); Height - Seated (Max): 0.026" (0.65mm); LastUpdated: 7/25/2024 09:21:27; Lifecycle Status: Active; Minimum Order: 1; Number of Terminations: 2; Operating Temperature: -55°C ~ 155°C; Package / Case: 1206 (3216 Metric); Packaging: TapeAndReel; PartId: 40465; Part Status: Active; Price: 0.01; Resistance: 1 kOhms; Series: RT; Size / Dimension: 0.122" L x 0.063" W (3.10mm x 1.60mm); Supplier 1: DigiKey; Supplier Part Number 1: YAG3366CT-ND; Supplier Device Package: 1206; Tolerance: ±1%; Value: 1 kOhms
R124 R125 = RT1206FRE073K3L: as R38#1 on sheet vca_A; Part Number: RT1206FRE073K3L; ComponentLink1Description: Datasheet; ComponentLink1URL: https://www.yageo.com/upload/media/product/productsearch/datasheet/rchip/PYu-RT_1-to-0.01_RoHS_L_12.pdf; ComponentLink2Description: DigiKey Link; ComponentLink2URL: https://www.digikey.com/en/products/detail/yageo/RT1206FRE073K3L/1083187; Composition: Thin Film; Device Package: 1206 (3216 Metric); Height - Seated (Max): 0.026" (0.65mm); LastUpdated: 7/25/2024 09:21:22; Lifecycle Status: Active; Minimum Order: 1; Number of Terminations: 2; Operating Temperature: -55°C ~ 155°C; Package / Case: 1206 (3216 Metric); Packaging: TapeAndReel; PartId: 58380; Price: 0.01; Resistance: 3.3 kOhms; Series: RT; Size / Dimension: 0.122" L x 0.063" W (3.10mm x 1.60mm); Supplier 1: DigiKey; Supplier Part Number 1: 13-RT1206FRE073K3LCT-ND; Supplier Device Package: 1206; Tolerance: ±1%; Value: 3.3 kOhms; Part Status: Active
R126 = TC33X-2-502G: Resistor; Manufacturer_Name: Bourns; Datasheet Link: https://componentsearchengine.com/Datasheets/1/TC33X-2-502G.pdf; Height: 1.2mm; Manufacturer_Part_Number: TC33X-2-502G; Mouser Part Number: 652-TC33X-2-502G; Mouser Price/Stock: https://www.mouser.co.uk/ProductDetail/Bourns/TC33X-2-502G?qs=UmpSLsh52mVfPYqLYJpjzQ%3D%3D; Arrow Part Number: TC33X-2-502G; Arrow Price/Stock: https://www.arrow.com/en/products/tc33x-2-502g/bourns?region=nac
R127-R130 = RT1206BRD071RL: as R41#1 on sheet vca_A; Part Number: RT1206BRD071RL; ComponentLink1Description: Datasheet; ComponentLink1URL: https://www.yageo.com/upload/media/product/productsearch/datasheet/rchip/PYu-RT_1-to-0.01_RoHS_L_15.pdf; ComponentLink2Description: DigiKey Link; ComponentLink2URL: https://www.digikey.com/en/products/detail/yageo/RT1206BRD071RL/17018181; Composition: Thin Film; Device Package: 1206 (3216 Metric); Features: Moisture Resistant; Height - Seated (Max): 0.026" (0.65mm); LastUpdated: 7/25/2024 09:21:16; Lifecycle Status: Active; Minimum Order: 1; Number of Terminations: 2; Operating Temperature: -55°C ~ 155°C; Package / Case: 1206 (3216 Metric); Packaging: TapeAndReel; PartId: 79150; Price: 0.14; Resistance: 1 Ohms; Series: RT; Size / Dimension: 0.122" L x 0.063" W (3.10mm x 1.60mm); Supplier 1: DigiKey; Supplier Part Number 1: 13-RT1206BRD071RLCT-ND; Supplier Device Package: 1206; Tolerance: ±0.1%; Value: 1 Ohms
U15 = TLV9362: as U3 on sheet vca_A; ComponentLink1Description: Datasheet; ComponentLink1URL: https://www.ti.com/lit/ds/symlink/tlv9362.pdf

## Sheet filters.SchDoc
size 381 x 241 mm; SheetNumber: 1; SheetTotal: 5
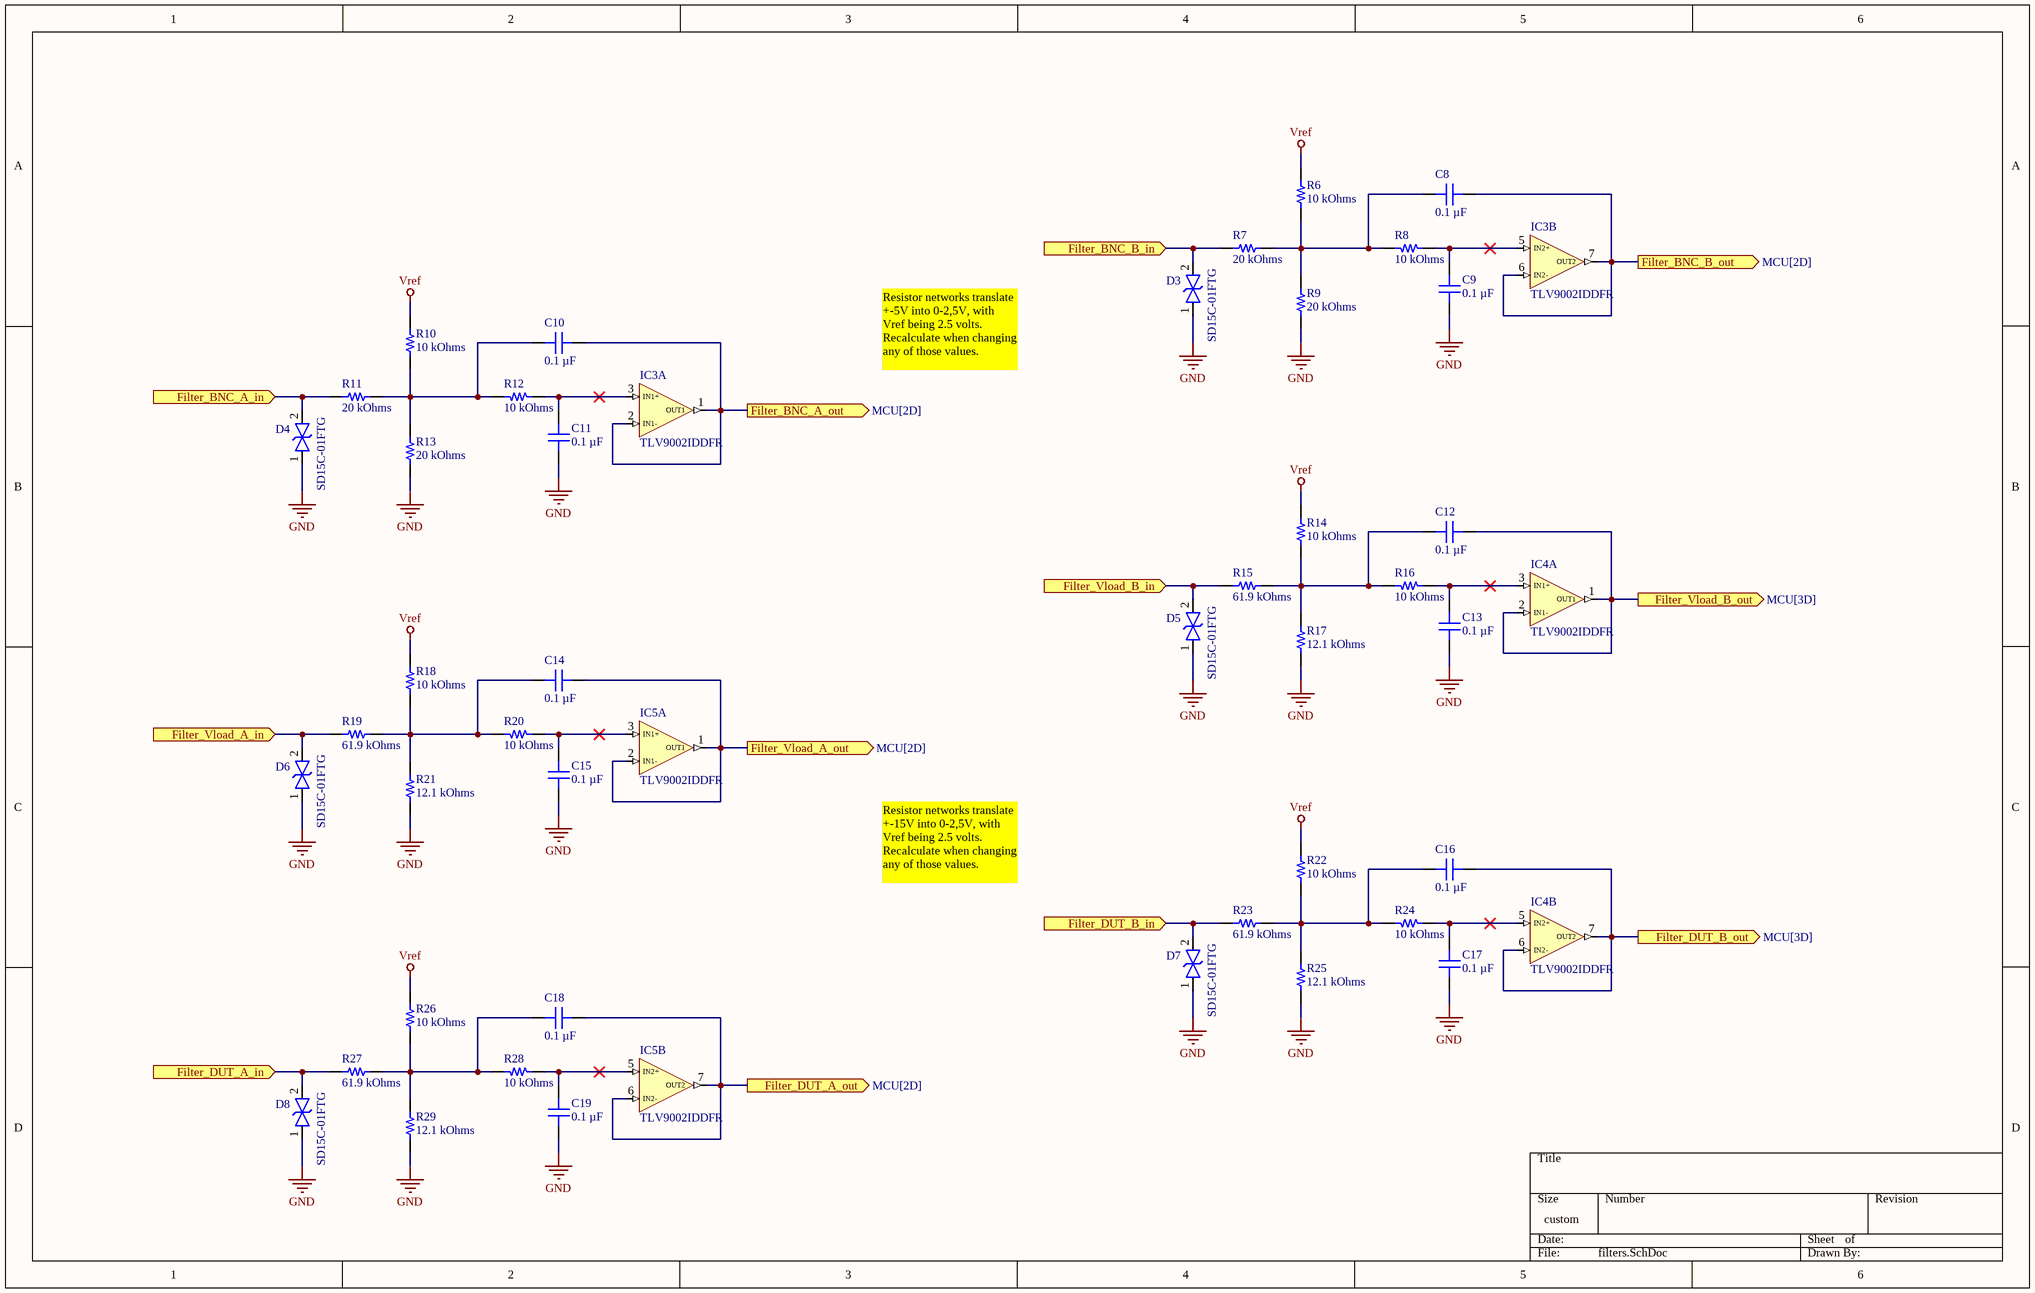
[diagram p4: filters.SchDoc]

### Parts
(Parts that share a designator on the sheet are numbered #1, #2 ... from top to bottom, then left to right.)
C8#1  0.1 µF  [CAP 1206_3216 - 0.8MM]
C9  0.1 µF  [CAP 1206_3216 - 0.8MM]
C10  0.1 µF  [CAP 1206_3216 - 0.8MM]
C11#2  0.1 µF  [CAP 1206_3216 - 0.8MM]
C12  0.1 µF  [CAP 1206_3216 - 0.8MM]
C13  0.1 µF  [CAP 1206_3216 - 0.8MM]
C14  0.1 µF  [CAP 1206_3216 - 0.8MM]
C15  0.1 µF  [CAP 1206_3216 - 0.8MM]
C16  0.1 µF  [CAP 1206_3216 - 0.8MM]
C17  0.1 µF  [CAP 1206_3216 - 0.8MM]
C18  0.1 µF  [CAP 1206_3216 - 0.8MM]
C19  0.1 µF  [CAP 1206_3216 - 0.8MM]
D3#1  SD15C-01FTG  [SD15C01FTG]
D4#1  SD15C-01FTG  [SD15C01FTG]
D5#1  SD15C-01FTG  [SD15C01FTG]
D6#2  SD15C-01FTG  [SD15C01FTG]
D7#1  SD15C-01FTG  [SD15C01FTG]
D8#1  SD15C-01FTG  [SD15C01FTG]
IC3  TLV9002IDDFR  [SOT65P280X110-8N]  (parts A,B of 3)
IC4  TLV9002IDDFR  [SOT65P280X110-8N]  (parts A,B of 3)
IC5  TLV9002IDDFR  [SOT65P280X110-8N]  (parts A,B of 3)
R6#2  10 kOhms  [RES 1206_3216]
R7#2  20 kOhms  [RES 1206_3216]
R8#2  10 kOhms  [YAGEO RES 1206_3216]
R9#2  20 kOhms  [RES 1206_3216]
R10#2  10 kOhms  [RES 1206_3216]
R11#2  20 kOhms  [RES 1206_3216]
R12#2  10 kOhms  [YAGEO RES 1206_3216]
R13#2  20 kOhms  [RES 1206_3216]
R14#2  10 kOhms  [RES 1206_3216]
R15#2  61.9 kOhms  [RES 1206_3216]
R16#2  10 kOhms  [YAGEO RES 1206_3216]
R17#2  12.1 kOhms  [RES 1206_3216]
R18#2  10 kOhms  [RES 1206_3216]
R19#2  61.9 kOhms  [RES 1206_3216]
R20#2  10 kOhms  [YAGEO RES 1206_3216]
R21#2  12.1 kOhms  [RES 1206_3216]
R22#2  10 kOhms  [RES 1206_3216]
R23#2  61.9 kOhms  [RES 1206_3216]
R24#2  10 kOhms  [YAGEO RES 1206_3216]
R25#2  12.1 kOhms  [RES 1206_3216]
R26#2  10 kOhms  [RES 1206_3216]
R27#2  61.9 kOhms  [RES 1206_3216]
R28#2  10 kOhms  [YAGEO RES 1206_3216]
R29#2  12.1 kOhms  [RES 1206_3216]

### Ports
Filter_BNC_A_in (in), Filter_BNC_A_out (out, see MCU[2D]), Filter_BNC_B_in (in), Filter_BNC_B_out (out, see MCU[2D]), Filter_DUT_A_in (in), Filter_DUT_A_out (out, see MCU[2D]), Filter_DUT_B_in (in), Filter_DUT_B_out (out, see MCU[3D]), Filter_Vload_A_in (in), Filter_Vload_A_out (out, see MCU[2D]), Filter_Vload_B_in (in), Filter_Vload_B_out (out, see MCU[3D])

### Nets
GND: C9.2 C11#2.2 C13.2 C15.2 C17.2 C19.2 D3#1.1 D4#1.1 D5#1.1 D6#2.1 D7#1.1 D8#1.1 R9#2.2 R13#2.2 R17#2.2 R21#2.2 R25#2.2 R29#2.2
Vref: R6#2.1 R10#2.1 R14#2.1 R18#2.1 R22#2.1 R26#2.1
NetC8#1_1: C8#1.1 IC3.6(IN2-) IC3.7(OUT2) ; port Filter_BNC_B_out
NetC8#1_2: C8#1.2 R6#2.2 R7#2.2 R8#2.2 R9#2.1
NetC9_1: C9.1 IC3.5(IN2+) R8#2.1
NetC10_1: C10.1 IC3.1(OUT1) IC3.2(IN1-) ; port Filter_BNC_A_out
NetC10_2: C10.2 R10#2.2 R11#2.2 R12#2.2 R13#2.1
NetC11#2_1: C11#2.1 IC3.3(IN1+) R12#2.1
NetC12_1: C12.1 IC4.1(OUT1) IC4.2(IN1-) ; port Filter_Vload_B_out
NetC12_2: C12.2 R14#2.2 R15#2.2 R16#2.2 R17#2.1
NetC13_1: C13.1 IC4.3(IN1+) R16#2.1
NetC14_1: C14.1 IC5.1(OUT1) IC5.2(IN1-) ; port Filter_Vload_A_out
NetC14_2: C14.2 R18#2.2 R19#2.2 R20#2.2 R21#2.1
NetC15_1: C15.1 IC5.3(IN1+) R20#2.1
NetC16_1: C16.1 IC4.6(IN2-) IC4.7(OUT2) ; port Filter_DUT_B_out
NetC16_2: C16.2 R22#2.2 R23#2.2 R24#2.2 R25#2.1
NetC17_1: C17.1 IC4.5(IN2+) R24#2.1
NetC18_1: C18.1 IC5.6(IN2-) IC5.7(OUT2) ; port Filter_DUT_A_out
NetC18_2: C18.2 R26#2.2 R27#2.2 R28#2.2 R29#2.1
NetC19_1: C19.1 IC5.5(IN2+) R28#2.1
NetD3#1_2: D3#1.2 R7#2.1 ; port Filter_BNC_B_in
NetD4#1_2: D4#1.2 R11#2.1 ; port Filter_BNC_A_in
NetD5#1_2: D5#1.2 R15#2.1 ; port Filter_Vload_B_in
NetD6#2_2: D6#2.2 R19#2.1 ; port Filter_Vload_A_in
NetD7#1_2: D7#1.2 R23#2.1 ; port Filter_DUT_B_in
NetD7#2_2: D8#1.2 R27#2.1 ; port Filter_DUT_A_in

### Notes on the sheet
- Resistor networks translate +-5V into 0-2,5V, with Vref being 2.5 volts. Recalculate when changing any of those values.
- Resistor networks translate +-15V into 0-2,5V, with Vref being 2.5 volts. Recalculate when changing any of those values.

### Library data of the parts
C8#1 C9 C10 C11#2 C12-C19 = 885012208087: as C54#1 on sheet vca_A; Part Number: 885012208087; Capacitance: 0.1 µF; Applications: General Purpose; componentlink1description: Datasheet; componentlink1url: https://katalog.we-online.de/pbs/datasheet/885012208087.pdf; componentlink2description: DigiKey Link; componentlink2url: https://www.digikey.com/en/products/detail/würth-elektronik/885012208087/5453982; Device Package: 1206 (3216 Metric); lastupdated: 6/4/2024 19:10:27; Lifecycle Status: Active; Minimum Order: 1; Mounting Type: Surface Mount, MLCC; Operating Temperature: -55°C ~ 125°C; Package / Case: 1206 (3216 Metric); packaging: TapeAndReel; partid: 20879; Part Status: Active; price: 0.06; series: WCAP-CSGP; Size / Dimension: 0.126" L x 0.063" W (3.20mm x 1.60mm); Supplier 1: DigiKey; Supplier Part Number 1: 732-8127-1-ND; Temperature Coefficient: X7R; Thickness (Max): 0.035" (0.90mm); value: 0.1 µF; Voltage - Rated: 50V
D3#1 D4#1 D5#1 D6#2 D7#1 D8#1 = SD15C-01FTG: TVS Diode (Bi-directional); Manufacturer_Name: LITTELFUSE; Datasheet Link: https://www.arrow.com/en/products/sd15c-01ftg/littelfuse; Height: 1.14mm; Manufacturer_Part_Number: SD15C-01FTG; Mouser Part Number: 576-SD15C-01FTG; Mouser Price/Stock: https://www.mouser.co.uk/ProductDetail/Littelfuse/SD15C-01FTG?qs=4zl93aaztU8pjSvpxpJP6g%3D%3D; Arrow Part Number: SD15C-01FTG; Arrow Price/Stock: https://www.arrow.com/en/products/sd15c-01ftg/littelfuse?region=nac
IC3-IC5 = TLV9002IDDFR: Integrated Circuit; Manufacturer_Name: Texas Instruments; Datasheet Link: https://www.ti.com/lit/gpn/TLV9002; Height: 1.1mm; Manufacturer_Part_Number: TLV9002IDDFR; Mouser Part Number: 595-TLV9002IDDFR; Mouser Price/Stock: https://www.mouser.co.uk/ProductDetail/Texas-Instruments/TLV9002IDDFR?qs=mAH9sUMRCtuVJ6NmNV%252Bgrw%3D%3D; Arrow Part Number: TLV9002IDDFR; Arrow Price/Stock: https://www.arrow.com/en/products/tlv9002iddfr/texas-instruments?utm_currency=USD&region=nac
R6#2 R10#2 R14#2 R18#2 R22#2 R26#2 = ERA-8AEB103V: RES SMD 10K OHM 0.1% 1/4W 1206; Manufacturer: Panasonic Electronic Components; Power (Watts): 0.25W, 1/4W; Temperature Coefficient: ±25ppm/°C; Part Number: ERA-8AEB103V; ComponentLink1Description: Datasheet; ComponentLink1URL: https://industrial.panasonic.com/cdbs/www-data/pdf/RDM0000/AOA0000C307.pdf; ComponentLink2Description: DigiKey Link; ComponentLink2URL: https://www.digikey.com/en/products/detail/panasonic-electronic-components/ERA-8AEB103V/3070742; Composition: Thin Film; Device Package: 1206 (3216 Metric); Features: Automotive AEC-Q200; Height - Seated (Max): 0.028" (0.70mm); LastUpdated: 2/9/2024 20:54:17; Lifecycle Status: Active; Minimum Order: 1; Number of Terminations: 2; Operating Temperature: -55°C ~ 155°C; Package / Case: 1206 (3216 Metric); Packaging: TapeAndReel; PartId: 33990; Part Status: Active; Price: 0.10; Ratings: AEC-Q200; Resistance: 10 kOhms; Series: ERA-8A; Size / Dimension: 0.126" L x 0.063" W (3.20mm x 1.60mm); Supplier 1: DigiKey; Supplier Part Number 1: P10KBCCT-ND; Supplier Device Package: 1206; Tolerance: ±0.1%; Value: 10 kOhms
R7#2 R9#2 R11#2 R13#2 = ERA-8AEB203V: RES SMD 20K OHM 0.1% 1/4W 1206; Manufacturer: Panasonic Electronic Components; Power (Watts): 0.25W, 1/4W; Temperature Coefficient: ±25ppm/°C; Part Number: ERA-8AEB203V; ComponentLink1Description: Datasheet; ComponentLink1URL: https://industrial.panasonic.com/cdbs/www-data/pdf/RDM0000/AOA0000C307.pdf; ComponentLink2Description: DigiKey Link; ComponentLink2URL: https://www.digikey.com/en/products/detail/panasonic-electronic-components/ERA-8AEB203V/3070867; Composition: Thin Film; Device Package: 1206 (3216 Metric); Features: Automotive AEC-Q200; Height - Seated (Max): 0.028" (0.70mm); LastUpdated: 2/9/2024 20:54:17; Lifecycle Status: Active; Minimum Order: 1; Number of Terminations: 2; Operating Temperature: -55°C ~ 155°C; Package / Case: 1206 (3216 Metric); Packaging: TapeAndReel; PartId: 33988; Part Status: Active; Price: 0.10; Ratings: AEC-Q200; Resistance: 20 kOhms; Series: ERA-8A; Size / Dimension: 0.126" L x 0.063" W (3.20mm x 1.60mm); Supplier 1: DigiKey; Supplier Part Number 1: P20KBCCT-ND; Supplier Device Package: 1206; Tolerance: ±0.1%; Value: 20 kOhms
R8#2 R12#2 R16#2 R20#2 R24#2 R28#2 = RT1206FRE0710KL: as R27#1 on sheet vca_A; Part Number: RT1206FRE0710KL; ComponentLink1Description: Datasheet; ComponentLink1URL: https://www.yageo.com/upload/media/product/productsearch/datasheet/rchip/PYu-RT_1-to-0.01_RoHS_L_11.pdf; ComponentLink2Description: DigiKey Link; ComponentLink2URL: https://www.digikey.com/en/products/detail/yageo/RT1206FRE0710KL/1082868; Composition: Thin Film; Device Package: 1206 (3216 Metric); Height - Seated (Max): 0.026" (0.65mm); LastUpdated: 7/25/2024 09:21:28; Lifecycle Status: Active; Minimum Order: 1; Number of Terminations: 2; Operating Temperature: -55°C ~ 155°C; Package / Case: 1206 (3216 Metric); Packaging: TapeAndReel; PartId: 38903; Part Status: Active; Price: 0.01; Resistance: 10 kOhms; Series: RT; Size / Dimension: 0.122" L x 0.063" W (3.10mm x 1.60mm); Supplier 1: DigiKey; Supplier Part Number 1: YAG1242CT-ND; Supplier Device Package: 1206; Tolerance: ±1%; Value: 10 kOhms
R15#2 R19#2 R23#2 R27#2 = ERA-8AEB6192V: RES SMD 61.9K OHM 0.1% 1/4W 1206; Manufacturer: Panasonic Electronic Components; Power (Watts): 0.25W, 1/4W; Temperature Coefficient: ±25ppm/°C; Part Number: ERA-8AEB6192V; ComponentLink1Description: Datasheet; ComponentLink1URL: https://industrial.panasonic.com/cdbs/www-data/pdf/RDM0000/AOA0000C307.pdf; ComponentLink2Description: DigiKey Link; ComponentLink2URL: https://www.digikey.com/en/products/detail/panasonic-electronic-components/ERA-8AEB6192V/3071114; Composition: Thin Film; Device Package: 1206 (3216 Metric); Features: Automotive AEC-Q200; Height - Seated (Max): 0.028" (0.70mm); LastUpdated: 2/9/2024 20:53:52; Lifecycle Status: Active; Minimum Order: 1; Number of Terminations: 2; Operating Temperature: -55°C ~ 155°C; Package / Case: 1206 (3216 Metric); Packaging: TapeAndReel; PartId: 41065; Part Status: Active; Price: 0.10; Ratings: AEC-Q200; Resistance: 61.9 kOhms; Series: ERA-8A; Size / Dimension: 0.126" L x 0.063" W (3.20mm x 1.60mm); Supplier 1: DigiKey; Supplier Part Number 1: P61.9KBCCT-ND; Supplier Device Package: 1206; Tolerance: ±0.1%; Value: 61.9 kOhms
R17#2 R21#2 R25#2 R29#2 = ERA-8AEB1212V: RES SMD 12.1K OHM 0.1% 1/4W 1206; Manufacturer: Panasonic Electronic Components; Power (Watts): 0.25W, 1/4W; Temperature Coefficient: ±25ppm/°C; Part Number: ERA-8AEB1212V; ComponentLink1Description: Datasheet; ComponentLink1URL: https://industrial.panasonic.com/cdbs/www-data/pdf/RDM0000/AOA0000C307.pdf; ComponentLink2Description: DigiKey Link; ComponentLink2URL: https://www.digikey.com/en/products/detail/panasonic-electronic-components/ERA-8AEB1212V/3070771; Composition: Thin Film; Device Package: 1206 (3216 Metric); Features: Automotive AEC-Q200; Height - Seated (Max): 0.028" (0.70mm); LastUpdated: 2/9/2024 20:54:30; Lifecycle Status: Active; Minimum Order: 1; Number of Terminations: 2; Operating Temperature: -55°C ~ 155°C; Package / Case: 1206 (3216 Metric); Packaging: TapeAndReel; PartId: 30396; Part Status: Active; Price: 0.10; Ratings: AEC-Q200; Resistance: 12.1 kOhms; Series: ERA-8A; Size / Dimension: 0.126" L x 0.063" W (3.20mm x 1.60mm); Supplier 1: DigiKey; Supplier Part Number 1: 10-ERA-8AEB1212VCT-ND; Supplier Device Package: 1206; Tolerance: ±0.1%; Value: 12.1 kOhms